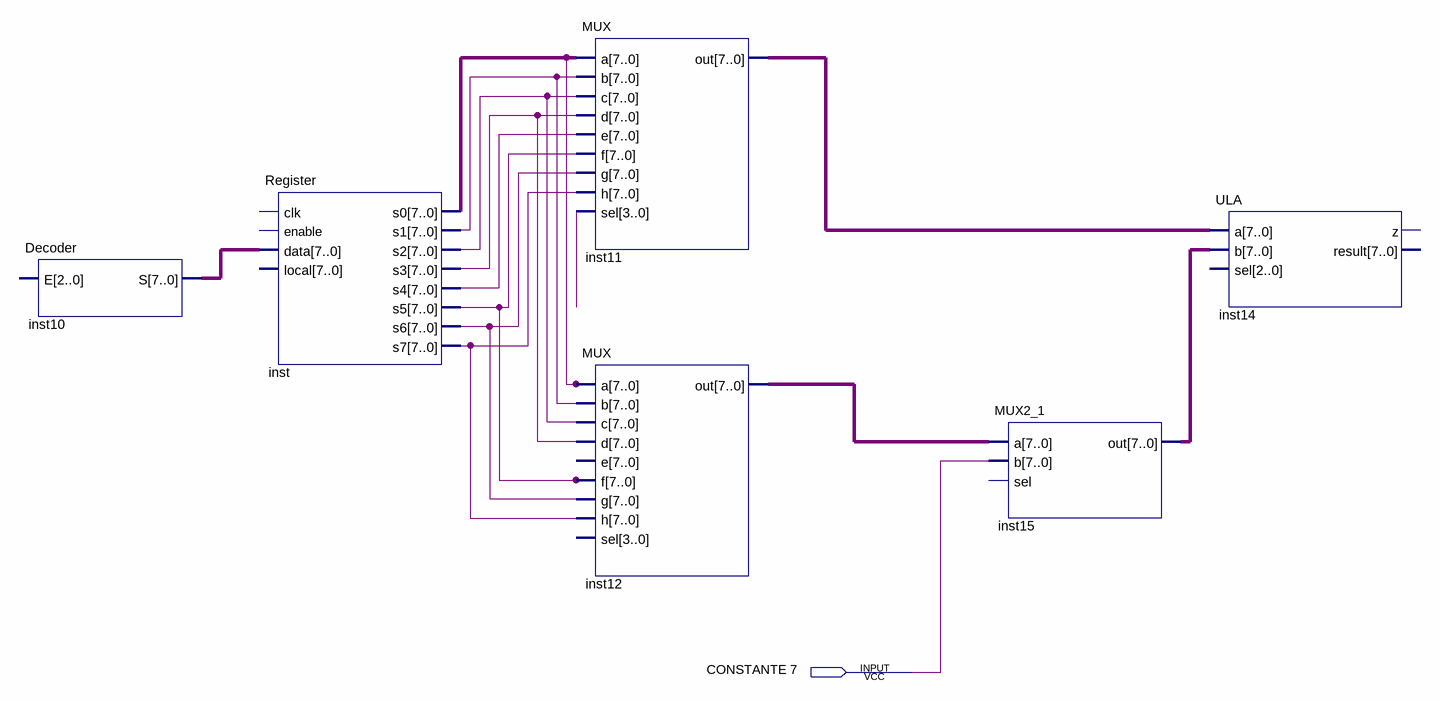
[diagram p0: schematic sheet]
// Quartus schematic Mod_teste.bdf as structural Verilog: 6 symbols, 1 pins
module Mod_teste (
  input  \CONSTANTE_7 
);

  wire undriven, undriven_2;
  wire [7:0] inst10_s, inst11_out, inst12_out, inst15_out, inst_s0, inst_s1, inst_s2, inst_s3, inst_s4,
       inst_s5, inst_s6, inst_s7;

  Decoder inst10 (.S(inst10_s));  // open: E
  Register inst (
    .data(inst10_s), .s0(inst_s0), .s1(inst_s1), .s2(inst_s2), .s3(inst_s3), .s4(inst_s4), .s5(inst_s5),
    .s6(inst_s6), .s7(inst_s7));  // open: clk, enable, local
  MUX inst11 (
    .a(inst_s0), .b(inst_s1), .c(inst_s2), .d(inst_s3), .e(inst_s4), .f(inst_s5), .g(inst_s6), .h(inst_s7),
    .sel({4{undriven}}), .out(inst11_out));
  MUX inst12 (
    .a({8{undriven_2}}), .b(inst_s1), .c(inst_s2), .d(inst_s3), .f(inst_s5), .g(inst_s6), .h(inst_s7),
    .out(inst12_out));  // open: e, sel
  MUX2_1 inst15 (.a(inst12_out), .b({8{\CONSTANTE_7 }}), .out(inst15_out));  // open: sel
  ULA inst14 (.a(inst11_out), .b(inst15_out));  // open: sel, z, result
endmodule
